# Altium schematic sheet DAC.SchDoc
size A3; Date: 27.05.2014; DrawnBy: luths8; Organization: BFH; Address1: Bern University of Applied Sciences; Address2: Engineering and Information Technology; Address3: Jlcoweg 1; Address4: CH-3400 Burgdorf; DocumentNumber: 10; Revision: 1.1; SheetNumber: 3; SheetTotal: 3; CurrentDate: 27.05.2014
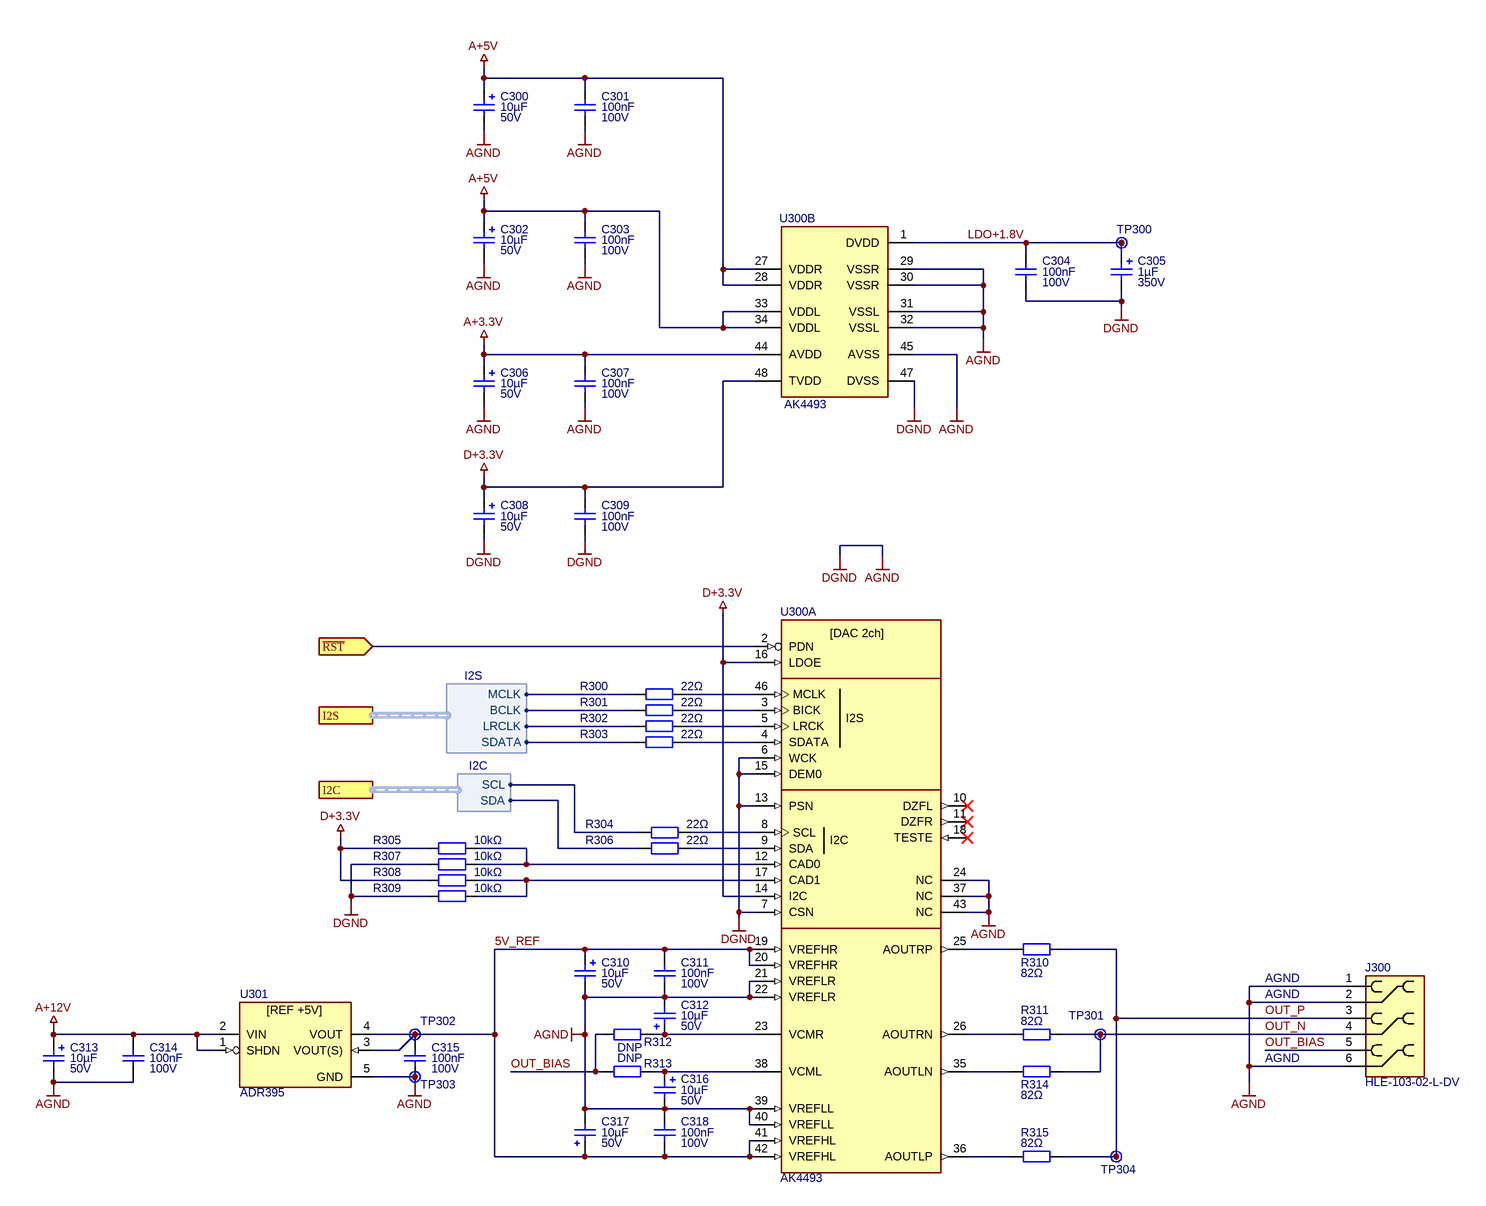
[diagram p0: DAC.SchDoc]

## Parts
C300  10µF  Voltage: 50V  [CAP-5-11.5-2]
C301  100nF  Voltage: 100V  [CAP_WIMA_MKP4F]
C302  10µF  Voltage: 50V  [CAP-5-11.5-2]
C303  100nF  Voltage: 100V  [CAP_WIMA_MKP4F]
C304  100nF  Voltage: 100V  [CAP_WIMA_MKP4F]
C305  1µF  Voltage: 350V  [CAP-6.3-11.2-2.5]
C306  10µF  Voltage: 50V  [CAP-5-11.5-2]
C307  100nF  Voltage: 100V  [CAP_WIMA_MKP4F]
C308  10µF  Voltage: 50V  [CAP-5-11.5-2]
C309  100nF  Voltage: 100V  [CAP_WIMA_MKP4F]
C310  10µF  Voltage: 50V  [CAP-5-11.5-2]
C311  100nF  Voltage: 100V  [CAP_WIMA_MKP4F]
C312  10µF  Voltage: 50V  [CAP-5-11.5-2]
C313  10µF  Voltage: 50V  [CAP-5-11.5-2]
C314  100nF  Voltage: 100V  [CAP_WIMA_MKP4F]
C315  100nF  Voltage: 100V  [CAP_WIMA_MKP4F]
C316  10µF  Voltage: 50V  [CAP-5-11.5-2]
C317  10µF  Voltage: 50V  [CAP-5-11.5-2]
C318  100nF  Voltage: 100V  [CAP_WIMA_MKP4F]
J300  HLE-103-02-L-DV  [HLE-103-02-XXX-DV]
R300  22Ω  [SMD0603RES]
R301  22Ω  [SMD0603RES]
R302  22Ω  [SMD0603RES]
R303  22Ω  [SMD0603RES]
R304  22Ω  [SMD0603RES]
R305  10kΩ  [SMD0603RES]
R306  22Ω  [SMD0603RES]
R307  10kΩ  [SMD0603RES]
R308  10kΩ  [SMD0603RES]
R309  10kΩ  [SMD0603RES]
R310  82Ω  [SMD0603RES]
R311  82Ω  [SMD0603RES]
R312  DNP  [SMD0603RES]
R313  DNP  [SMD0603RES]
R314  82Ω  [SMD0603RES]
R315  82Ω  [SMD0603RES]
TP300  Testpoint  [TP]  (value not drawn)  (no BOM)
TP301  Testpoint  [TP]  (value not drawn)  (no BOM)
TP302  Testpoint  [TP]  (value not drawn)  (no BOM)
TP303  Testpoint  [TP]  (value not drawn)  (no BOM)
TP304  Testpoint  [TP]  (value not drawn)  (no BOM)
U300  AK4493  [LQFP48]  (parts A,B of 2)
U301  ADR395  [SOT-23-5]

## Ports
I2C (harness I2C), I2S (harness I2S), ~{RST} (in)

## Harnesses
I2S: MCLK, BCLK, LRCLK, SDATA
I2C: SCL, SDA

## Nets
A+3.3V: C306.P C307.2(q) U300.44(AVDD)
A+5V: C300.P C301.2(q) C302.P C303.2(q) U300.27(VDDR) U300.28(VDDR) U300.33(VDDL) U300.34(VDDL)
A+12V: C313.P C314.2(q) U301.1(SHDN) U301.2(VIN)
AGND: C300.M(q) C301.1 C302.M(q) C303.1 C304.1 C305.M(q) C306.M(q) C307.1 C308.M(q) C309.1 C310.M(q) C311.1 C312.M(q) C313.M(q) C314.1 C315.1 C316.M(q) C317.M(q) C318.2(q) J300.1 J300.2 J300.6 R307.2 R309.2 TP303.1 U300.6(WCK) U300.7(CSN) U300.13(PSN) U300.15(DEM0) U300.21(VREFLR) U300.22(VREFLR) U300.24(NC) U300.29(VSSR) U300.30(VSSR) U300.31(VSSL) U300.32(VSSL) U300.37(NC) U300.39(VREFLL) U300.40(VREFLL) U300.43(NC) U300.45(AVSS) U300.47(DVSS) U301.5(GND)  [also labelled DGND]
D+3.3V: C308.P C309.2(q) R305.2 R308.2 U300.14(I2C) U300.16(LDOE) U300.48(TVDD)
5V_REF: C310.P C311.2(q) C315.2(q) C317.P C318.1 TP302.1 U300.19(VREFHR) U300.20(VREFHR) U300.41(VREFHL) U300.42(VREFHL) U301.3(VOUT(S)) U301.4(VOUT)
LDO+1.8V: C304.2(q) C305.P TP300.1 U300.1(DVDD)
OUT_BIAS: J300.5 R312.2 R313.2
OUT_N: J300.4 R311.1 R314.1 TP301.1
OUT_P: J300.3 R310.1 R315.1 TP304.1
~{RST}: U300.2(PDN) ; port ~{RST}
NetC312_P: C312.P R312.1 U300.23(VCMR)
NetC316_P: C316.P R313.1 U300.38(VCML)
NetR300_1: R300.1 U300.46(MCLK)
NetR300_2: R300.2 ; port I2S.MCLK
NetR301_1: R301.1 U300.3(BICK)
NetR301_2: R301.2 ; port I2S.BCLK
NetR302_1: R302.1 U300.5(LRCK)
NetR302_2: R302.2 ; port I2S.LRCLK
NetR303_1: R303.1 U300.4(SDATA)
NetR303_2: R303.2 ; port I2S.SDATA
NetR304_1: R304.1 U300.8(SCL)
NetR304_2: R304.2 ; port I2C.SCL
NetR305_1: R305.1 R307.1 U300.12(CAD0)
NetR306_1: R306.1 U300.9(SDA)
NetR306_2: R306.2 ; port I2C.SDA
NetR308_1: R308.1 R309.1 U300.17(CAD1)
NetR310_2: R310.2 U300.25(AOUTRP)
NetR311_2: R311.2 U300.26(AOUTRN)
NetR314_2: R314.2 U300.35(AOUTLN)
NetR315_2: R315.2 U300.36(AOUTLP)

Not connected (* = marked no-connect by the designer): U300 10(DZFL)* 11(DZFR)* 18(TESTE)*

## Notes on the sheet
- AGND
- Project:
- Size:
- Sheet:
- Title:
- A3
- of
- Drawn by:
- Revision:
- Date:
- Variant:
- b
- File:
- (in symbol ADR395) [REF +5V]
- (in symbol AK4493, part A) [DAC 2ch]; I2S

## Library data of the parts
C300 C302 C306 C308 C310 C312 C313 C316 C317 = Capacitor Electrolytic: Elektrolytic Capacitor; Manufacturer Part No.: EEU-FR1H100
C301 C303 C304 C307 C309 C311 C314 C315 C318 = Capacitor Ceramic: Ceramic Capacitor; Manufacturer Part No.: MKP2D031001F00KF00
C305 = Capacitor Electrolytic: Elektrolytic Capacitor; Supplier 1: Mouser; Supplier Part Number 1: 667-ECA-2VM010; Manufacturer Part No.: *
J300 = Receptacle 3x2P: Manufacturer Part No.: HLE-103-02-L-DV
R300-R309 R312 R313 = Resistor: Manufacturer Part No.: *
R310 R311 R314 R315 = Resistor: Resistor Thin Film; Manufacturer Part No.: TNPW060322R0BEEA
U300 = AK4493: 32-Bit 2ch Audio DAC; Manufacturer Part No.: AK4493EQ
U301 = ADR395: Manufacturer Part No.: ADR395BUJZ-REEL7
TP300-TP304 = Testpoint: Manufacturer Part No.: *